# Altium schematic sheet Buck_TPSM82913_5V5.SchDoc
size B; SheetNumber: 13; SheetTotal: 15
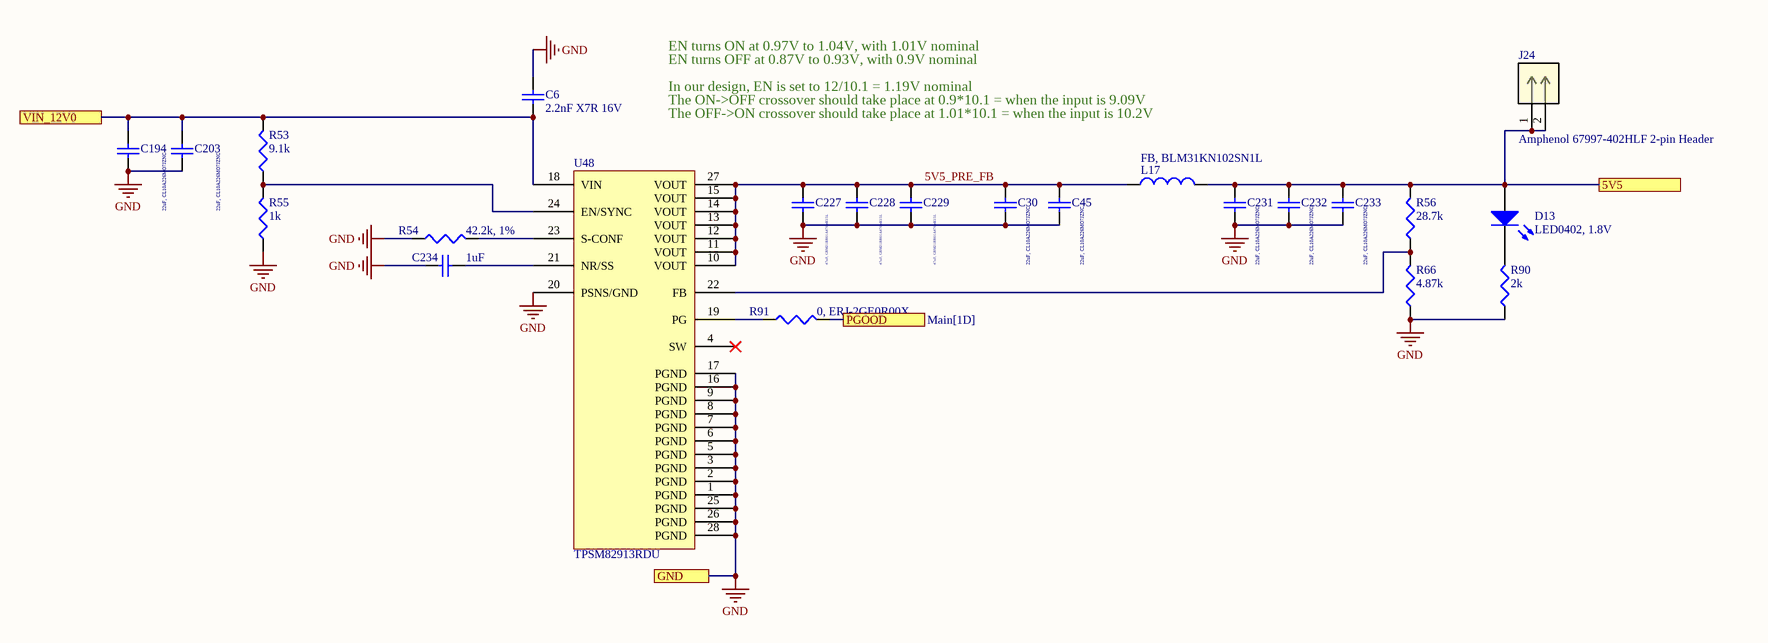
[diagram p0: Buck_TPSM82913_5V5.SchDoc]

## Parts
C6  2.2nF X7R 16V  [SMD-0402]
C30  22uF, CL10A226MO7JZNC  [SMD-0603]
C45  22uF, CL10A226MO7JZNC  [SMD-0603]
C194  22uF, CL10A226MO7JZNC  [SMD-0603]
C203  22uF, CL10A226MO7JZNC  [SMD-0603]
C227  47uF, GRM21BR61A476ME15L  [SMD-0805]
C228  47uF, GRM21BR61A476ME15L  [SMD-0805]
C229  47uF, GRM21BR61A476ME15L  [SMD-0805]
C231  22uF, CL10A226MO7JZNC  [SMD-0603]
C232  22uF, CL10A226MO7JZNC  [SMD-0603]
C233  22uF, CL10A226MO7JZNC  [SMD-0603]
C234  1uF  [SMD-0402]
D13  LED0402, 1.8V  [LED-0402]
J24  Amphenol 67997-402HLF 2-pin Header  [Amphenol  67997-402HLF 2-pin header]
L17  FB, BLM31KN102SN1L  [SMD-1206]
R53  9.1k  [SMD-0402]
R54  42.2k, 1%  [SMD-0402]
R55  1k  [SMD-0402]
R56  28.7k  [SMD-0402]
R66  4.87k  [SMD-0402]
R90  2k  [SMD-0402]
R91  0, ERJ-2GE0R00X  [SMD-0402]
U48  TPSM82913RDU  [TPSM82913DRUR]

## Ports
5V5 (see Main[2D], IQ_Demod[1D]), GND (see Main[2D], 3V7_to_3V3_LDO[1B], 5V5_to_5V0_LDO[1C], Buck_TPSM82913_1V8[3C], Buck_TPSM82913_3V7[3C], Buck_TPSM82913_5V0[3C], Clocking_and_LO[2A], Fan_Interfaces[2B], IQ_Demod[1C], IQ_Mod[1B], LMX2820[4D], Microzed_Interfaces[1A], Power_Supply[6B], Voltage_Conv_Bidirectional[1B]), PGOOD (see Main[1D]), VIN_12V0 (see Main[1D], Buck_TPSM82913_3V7[1B], Buck_TPSM82913_5V0[1B])

## Nets
GND: C6.2 C30.1 C45.1 C194.1 C203.1 C227.1 C228.1 C229.1 C231.1 C232.1 C233.1 C234.1 R54.1 R55.1 R66.1 R90.1 U48.1(PGND) U48.2(PGND) U48.3(PGND) U48.5(PGND) U48.6(PGND) U48.7(PGND) U48.8(PGND) U48.9(PGND) U48.16(PGND) U48.17(PGND) U48.20(PSNS/GND) U48.25(PGND) U48.26(PGND) U48.28(PGND) ; port GND
5V5: C231.2 C232.2 C233.2 D13.1(A) J24.1 J24.2 L17.2 R56.2 ; port 5V5
5V5_PRE_FB: C30.2 C45.2 C227.2 C228.2 C229.2 L17.1 U48.10(VOUT) U48.11(VOUT) U48.12(VOUT) U48.13(VOUT) U48.14(VOUT) U48.15(VOUT) U48.27(VOUT)
PGOOD: R91.2 ; port PGOOD
VIN_12V0: C6.1 C194.2 C203.2 R53.2 U48.18(VIN) ; port VIN_12V0
NetC234_2: C234.2 U48.21(NR/SS)
NetD13_2: D13.2(K) R90.2
NetR53_1: R53.1 R55.2 U48.24(EN/SYNC)
NetR54_2: R54.2 U48.23(S-CONF)
NetR56_1: R56.1 R66.2 U48.22(FB)
NetR91_1: R91.1 U48.19(PG)

Not connected (* = marked no-connect by the designer): U48 4(SW)*

## Notes on the sheet
- EN turns OFF at 0.87V to 0.93V, with 0.9V nominal
- EN turns ON at 0.97V to 1.04V, with 1.01V nominal
- In our design, EN is set to 12/10.1 = 1.19V nominal
- The ON->OFF crossover should take place at 0.9*10.1 = when the input is 9.09V
- The OFF->ON crossover should take place at 1.01*10.1 = when the input is 10.2V

## Library data of the parts
C6 C234 = CAP0402: Ceramic Capacitor 0402
C30 C45 C194 C203 C231-C233 = CAP0603: Ceramic Capacitor 0603
C227-C229 = CAP0805: Ceramic Capacitor 0805 Imperial (2012 Metric)
D13 = LED0402: LED 0402
J24 = Amphenol 67997-402HLF 2-pin Header: No Description Available; Mfr_Name: Amphenol ICC; RefDes: RefDes; Type: Type
L17 = L1206: Inductor 1206
R53-R56 R66 R90 R91 = RES0402: Resistor-0402